# Altium schematic sheet power.SchDoc
size A; SheetNumber: 2; SheetTotal: 2
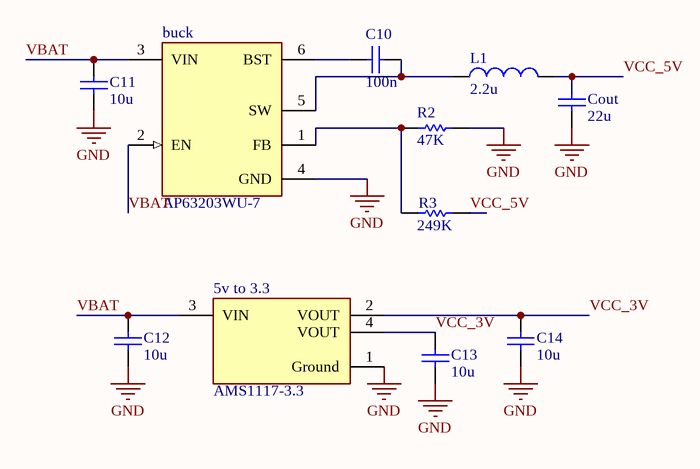
[diagram p0: power.SchDoc]

## Parts
5v_to_3.3  AMS1117-3.3  [FP-AMS1117-IPC_C]
buck  AP63203WU-7  [FP-TSOT26-MFG]
C10  value 100n  (hidden comment: Capacitor)
C11  value 10u  (hidden comment: Capacitor)
C12  value 10u  (hidden comment: Capacitor)
C13  value 10u  (hidden comment: Capacitor)
C14  value 10u  (hidden comment: Capacitor)
Cout  value 22u  (hidden comment: Capacitor)
L1  value 2.2u  (hidden comment: Inductor)
R2  value 47K  (hidden comment: Resistor)
R3  value 249K  (hidden comment: Resistor)

## Nets
GND: 5v_to_3.3.1(Ground) buck.4(GND) C11.2 C12.2 C13.2 C14.2 Cout.1 R2.2
VBAT: 5v_to_3.3.3(VIN) buck.2(EN) buck.3(VIN) C11.1 C12.1
VCC_3V: 5v_to_3.3.2(VOUT) 5v_to_3.3.4(VOUT) C13.1 C14.1
VCC_5V: Cout.2 L1.2 R3.2
Netbuck_1: buck.1(FB) R2.1 R3.1
Netbuck_5: buck.5(SW) C10.2 L1.1
Netbuck_6: buck.6(BST) C10.1

## Library data of the parts
5v_to_3.3 = CMP-209535-000001-1: LDO Voltage Regulators 1A, 3.3V; Manufacturer: Advanced Monolithic Systems; Dropout Voltage: 1.1V; Output Type: Fixed; Nominal Supply Current: 5mA; Max Power Dissipation: 1.2W; Max Supply Voltage: 15V; Number Of Outputs: 1; Standoff Height: 0.64mm; Max Junction Temp: +125°C; Height: 1.8mm; Package: AMS1117; Device Class L2: Power Management ICs; ComponentLink2Description: Datasheet; ComponentLink2URL: http://www.advanced-monolithic.com/pdf/ds1117.pdf; Category: IC; RoHS: TRUE; Automotive: No; Device Class L1: Integrated Circuits (ICs); Output Current: 1A; Device Class L3: Voltage Regulators - Linear; Temperature: -40°C to +125°C; Output Voltage: 3.3V; Manufacturer Part Number: AMS1117-3.3; Temperature Range Low: -40°C; Octopart: https://octopart.com/ams1117-3.3-advanced+monolithic+systems-25899300; Lead Free: Yes; Ipc Land Pattern Name: SOT229P700X180-4; Temperature Range High: +125°C
buck = CMP-12757-000006-1: IC REG BUCK 3.3V 2A TSOT26; Manufacturer: Diodes Inc.; Description: Buck Switching Regulator IC Positive Fixed 3.3V 1 Output 2A SOT-23-6 Thin, TSOT-23-6; Output Type: Fixed; Min Supply Voltage: 3.8V; Number Of Outputs: 1; Max Junction Temp: +160°C; Nominal Supply Current: 22uA; Standoff Height: 0.01mm; Switching Frequency: 1.1MHz; Max Supply Voltage: 32V; ComponentLink2Description: Datasheet; Device Class L1: Integrated Circuits (ICs); Temperature: to +160°C; Device Class L3: Voltage Regulators - Switching; RoHS: TRUE; Octopart: https://octopart.com/ap63203wu-7-diodes+inc.-98099550; Output Voltage: 3.3V; Lead Free: Yes; ComponentLink2URL: https://www.diodes.com/assets/Datasheets/AP63200-AP63201-AP63203-AP63205.pdf; Digikey Description: IC REG BUCK 3.3V 2A TSOT26; Footprint Url: https://www.diodes.com/assets/Package-Files/TSOT26.pdf; Ambient Temperature Range High: +85°C; Height: 1mm; Automotive: No; Temperature Range High: +160°C; Switching Topology: Buck; Output Current: 2A; Package: TSOT26; Category: IC; Mouser Description: AP63203 Series 3.3 V 2 A SMT Fixed Low IQ Synchronous Buck - TSOT-26; Device Class L2: Power Management ICs; Ambient Temperature Range Low: -40°C; Manufacturer Part Number: AP63203WU-7
C10-C14 Cout = Capacitor: SimulationGenericComponent: True
L1 = Inductor: SimulationGenericComponent: True
R2 R3 = Resistor: TC1: 0; SimulationGenericComponent: True; TC2: 0